# EAGLE design SensorNode (EAGLE 9.0.1)
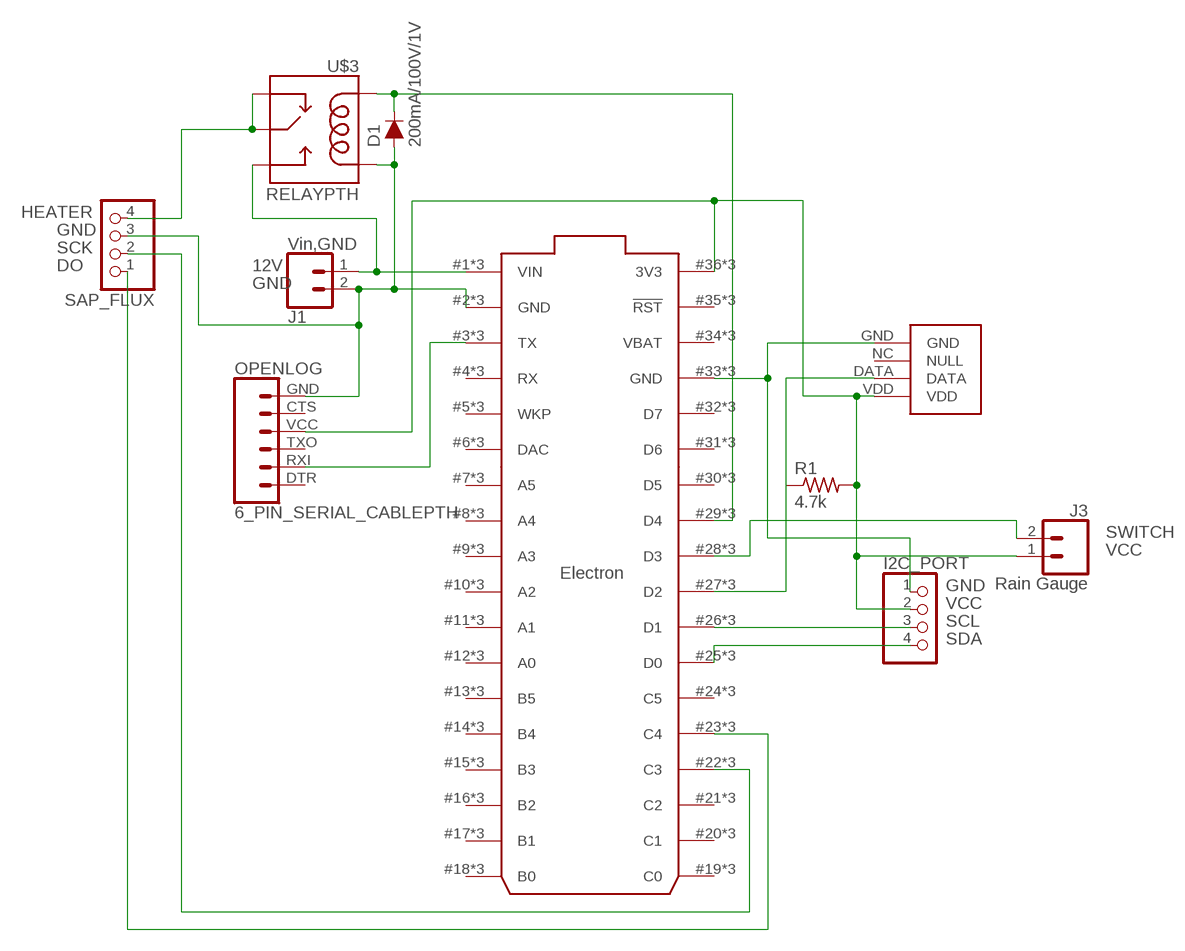
[diagram p0: schematic, sheet 1]

## Parts
D1  200mA/100V/1V  DIODE-1N4148  [DIODE-1N4148]
I2C_PORT  PINHD-1X4  [1X04]
J1  Vin,GND  CONN_023.5MM  [SCREWTERMINAL-3.5MM-2]
J3  Rain Gauge  CONN_023.5MM  [SCREWTERMINAL-3.5MM-2]
OPENLOG  6_PIN_SERIAL_CABLEPTH  [FTDI_BASIC]
R1  4.7k  R-US_0204/7  [0204/7]
SAP_FLUX  PINHD-1X4  [1X04]
U$1  ELECTRON_WITH_STACKABLE_HEADERS  [ELECTRON_STACKABLE]
U$2  DHT22  [DHT22]
U$3  RELAYPTH  [RELAY-G5Q]

## Nets
12V: J1.1 U$1.1(VIN) U$1.#1(VIN) U$1.@1(VIN) U$3.3(NO)
DO: SAP_FLUX.1 U$1.23(C4) U$1.#23(C4) U$1.@23(C4)
GND: D1.A I2C_PORT.1 J1.2 OPENLOG.GND SAP_FLUX.3 U$1.2(GND) U$1.33(GND) U$1.#2(GND) U$1.#33(GND) U$1.@2(GND) U$1.@33(GND) U$2.GND U$3.1(COIL2)
HEATER: SAP_FLUX.4 U$3.2(MAIN) U$3.4(NC)
N$4: OPENLOG.RXI U$1.3(TX) U$1.#3(TX) U$1.@3(TX)
N$7: U$1.27(D2) U$1.#27(D2) U$1.@27(D2) U$2.DATA
N$13: D1.C U$1.29(D4) U$1.#29(D4) U$1.@29(D4) U$3.5(COIL1)
SCK: SAP_FLUX.2 U$1.22(C3) U$1.#22(C3) U$1.@22(C3)
SCL: I2C_PORT.3 U$1.26(D1) U$1.#26(D1) U$1.@26(D1)
SDA: I2C_PORT.4 U$1.25(D0) U$1.#25(D0) U$1.@25(D0)
SWITCH: J3.2 U$1.28(D3) U$1.#28(D3) U$1.@28(D3)
VCC: I2C_PORT.2 J3.1 OPENLOG.VCC R1.2 U$1.36(3V3) U$1.#36(3V3) U$1.@36(3V3) U$2.VDD
Unconnected: OPENLOG.CTS OPENLOG.DTR OPENLOG.TXO R1.1 U$1.4(RX) U$1.5(WKP) U$1.6(DAC) U$1.7(A5) U$1.8(A4) U$1.9(A3) U$1.10(A2) U$1.11(A1) U$1.12(A0) U$1.13(B5) U$1.14(B4) U$1.15(B3) U$1.16(B2) U$1.17(B1) U$1.18(B0) U$1.19(C0) U$1.20(C1) U$1.21(C2) U$1.24(C5) U$1.30(D5) U$1.31(D6) U$1.32(D7) U$1.35(!RST) U$1.#4(RX) U$1.#5(WKP) U$1.#6(DAC) U$1.#7(A5) U$1.#8(A4) U$1.#9(A3) U$1.#10(A2) U$1.#11(A1) U$1.#12(A0) U$1.#13(B5) U$1.#14(B4) U$1.#15(B3) U$1.#16(B2) U$1.#17(B1) U$1.#18(B0) U$1.#19(C0) U$1.#20(C1) U$1.#21(C2) U$1.#24(C5) U$1.#30(D5) U$1.#31(D6) U$1.#32(D7) U$1.#35(!RST) U$1.@4(RX) U$1.@5(WKP) U$1.@6(DAC) U$1.@7(A5) U$1.@8(A4) U$1.@9(A3) U$1.@10(A2) U$1.@11(A1) U$1.@12(A0) U$1.@13(B5) U$1.@14(B4) U$1.@15(B3) U$1.@16(B2) U$1.@17(B1) U$1.@18(B0) U$1.@19(C0) U$1.@20(C1) U$1.@21(C2) U$1.@24(C5) U$1.@30(D5) U$1.@31(D6) U$1.@32(D7) U$1.@35(!RST) U$2.NC(NULL)

## Power pins joined to a net without a drawn wire
VBAT: U$1.34(VBAT) U$1.#34(VBAT) U$1.@34(VBAT)

## Library data of the parts
D1 = SparkFun-DiscreteSemi:DIODE: Diode These are standard reverse protection diodes and small signal diodes. SparkFun Products: SparkFun SparkPunk Sound Kit <https://www.sparkfun.com/products/11177> SparkFun ESP8266 Thing <https://www.sparkfun.com/products/13231>; PROD_ID: DIO-08378
I2C_PORT SAP_FLUX = DC_LOAD_AU:PINHD-1X4: PIN HEADER
J1 J3 = SparkFun-Connectors:CONN_02: Multi connection point. Often used as Generic Header-pin footprint for 0.1 inch spaced/style header connections On any of the 0.1 inch spaced packages, you can populate with these: Break Away Headers - Straight <https://www.sparkfun.com/products/116> (PRT-00116) Break Away Male Headers - Right Angle <https://www.sparkfun.com/products/553> (PRT-00553) Female Headers <https://www.sparkfun.com/products/115> (PRT-00115) Break Away Headers - Machine Pin <https://www.sparkfun.com/products/117> (PRT-00117) Break Away Female Headers - Swiss Machine Pin <https://www.sparkfun.com/products/743> (PRT-00743) For SCREWTERMINALS and SPRING TERMINALS visit here: Screw Terimnals on SparkFun.com <https://www.sparkfun.com/search/results?term=Screw+Terminals> (5mm/3.5mm/2.54mm spacing) This device is also useful as a general connection point to wire up your design to another part of your project. Our various solder wires solder well into these plated through hole pads. Hook-Up Wire - Assortment (Stranded, 22 AWG) <https://www.sparkfun.com/products/11375> (PRT-11375) Hook-Up Wire - Assortment (Solid Core, 22 AWG) <https://www.sparkfun.com/products/11367> (PRT-11367) View the entire wire category on our website here <https://www.sparkfun.com/categories/141> Special notes: Molex polarized connector foot print use with: PRT-08233 with associated crimp pins and housings. 2.54_SCREWTERM for use with PRT-10571. 3.5mm Screw Terminal footprints for PRT-08084 5mm Screw Terminal footprints for use with PRT-08432; PROD_ID: CONN-08399
OPENLOG = SparkFun-Connectors:6_PIN_SERIAL_CABLE: 6-pin header connection for use with the "FTDI BASIC" pinout - CABLE SIDE. Also known as "Arduino Serial Program Header". This is used on a design to provide a 6-pin connection point for serial communication usually from a USB cable (D+/D-) to these headers (RX/TX). It also has the remaining pins necessary for programming in the Arduino evironment (DTR, GND, and sometimes VCC). Note, this device has "CABLE" in the name. It is intended to be used on a design that usually lives on the end of your USB cable and prvides the converter chip (FTDI232 or FTDI231x) to commnicate serial RX/TX. The "sister" device, named "TARGET" is inteneded to be used on a design that contains a target micro-controller that you wish to program. You can populate with some of these: Female Headers <https://www.sparkfun.com/products/115> (PRT-00115) For reference (or to suit your programming needs) check out these designs: SparkFun FTDI Basic Breakout - 5V <https://www.sparkfun.com/products/9716> (DEV-09716) SparkFun FTDI Basic Breakout - 3.3V <https://www.sparkfun.com/products/9873> (DEV-09873) SparkFun FTDI SmartBasic <https://www.sparkfun.com/products/12935> (DEV-12935) SparkFun Beefy 3 - FTDI Basic Breakout <https://www.sparkfun.com/products/13746> (DEV-13746)
R1 = rcl:R-US_: RESISTOR, American symbol; SPICEPREFIX: R
U$1 = Particle-Devices:ELECTRON: The Particle Electron is a tiny development kit for creating cellular-connected electronics projects and products. It comes with a SIM card (Nano 4FF) and an affordable data plan for low-bandwidth things. Design files : here <https://github.com/particle-iot/electron> Product Page : Datasheet <https://docs.particle.io/datasheets/electron-(cellular)/electron-datasheet/> Github : Particle devices library <https://github.com/particle-iot/hardware-libraries/tree/master/Eagle>
U$2 = Particle:DHT22
U$3 = Particle:RELAY: SPDT relay (COM-00101)

## Board
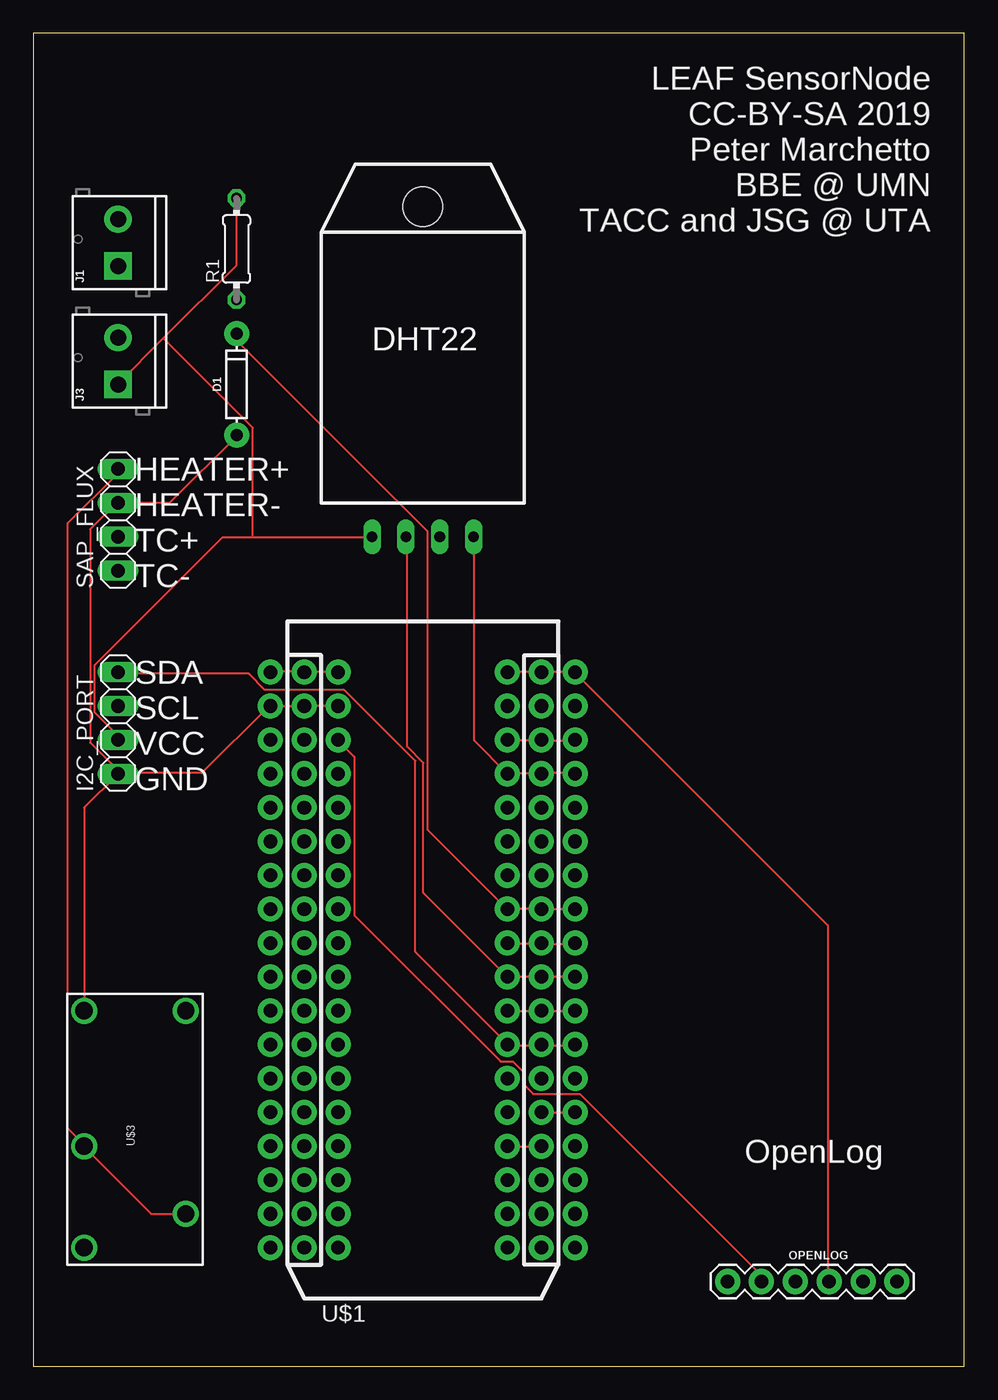
[diagram p1: board, top side]
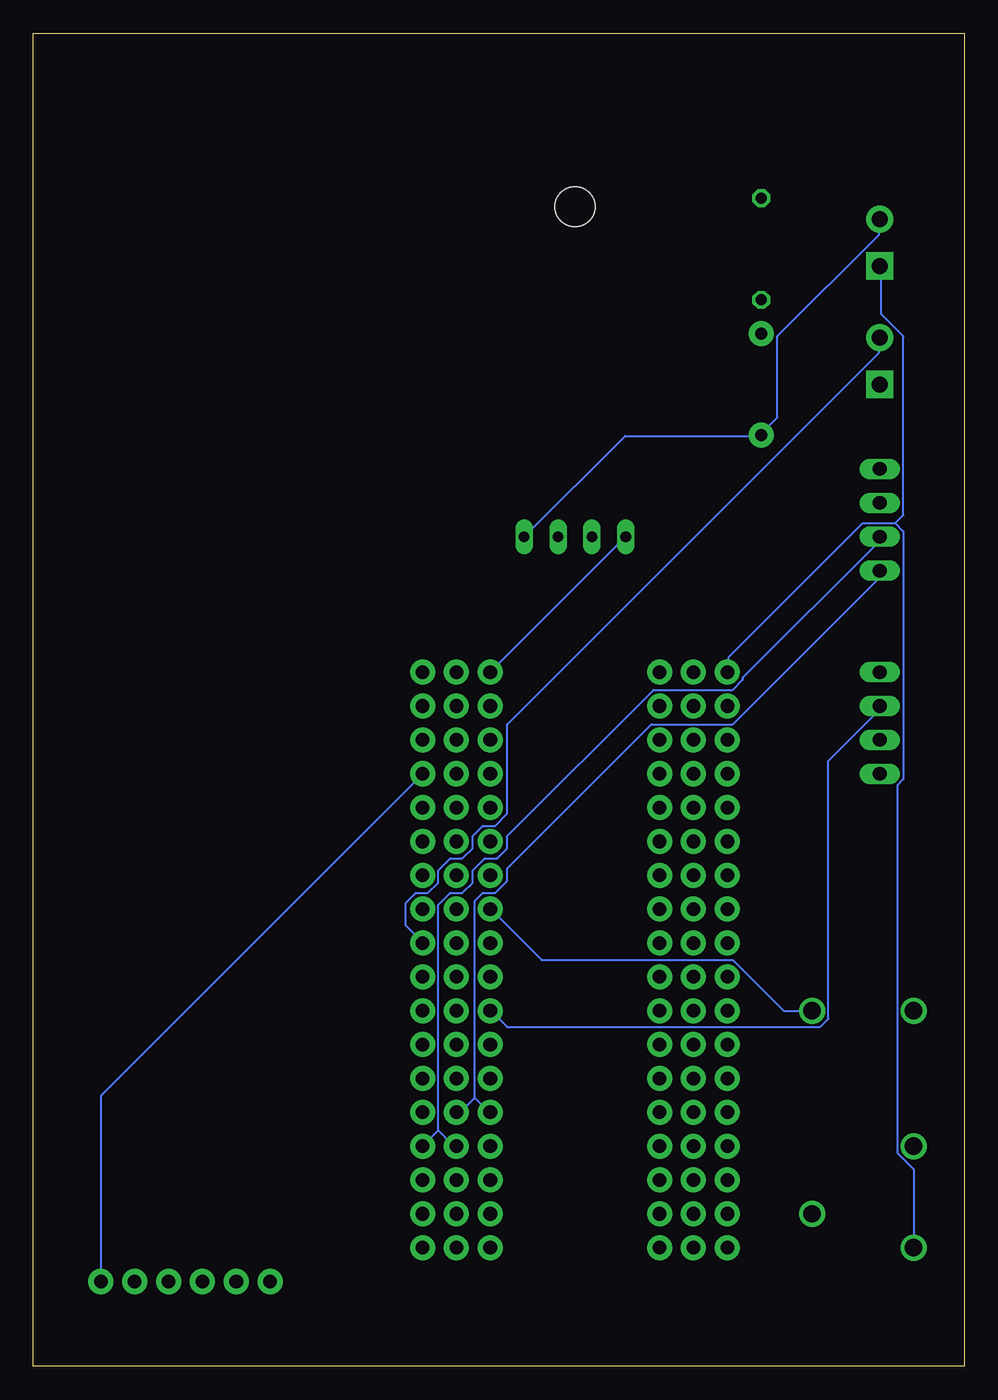
[diagram p2: board, bottom side, seen from below]

Size 69.83 x 100 mm. Coordinates in mm from the lower left corner, seen from the top.
Outline: 0,0 69.83,0 69.83,100 0,100 0,0
Copper layers (1*16): Top 0.035mm / dielectric 1.5mm / Bottom 0.035mm
Design rules "default": minimum track width 6mil, minimum drill 0.35mm, track to track 6mil, track to pad 6mil, pad to pad 6mil, via to via 6mil, smd to smd 6mil, copper to edge 40mil, drill to drill 6mil, minimum pad ring 10mil, minimum via ring 8mil, stop-mask expansion 4mil, vias tented up to drill 0mil, thermal gap 10mil

### Footprints (pad centres in the part's own frame; a part is rotated, then mirrored left to right if it is on the bottom)
DIODE-1N4148 = drill 0.9 pad 1.88: A -3.81,0; C 3.81,0
1X04 = drill 1.016 long: 1 -3.81,0; 2 -1.27,0; 3 1.27,0; 4 3.81,0
SCREWTERMINAL-3.5MM-2 = drill 1.2 pad 2.032 square: 1 0,0 | drill 1.2 pad 2.032: 2 3.5,0
FTDI_BASIC = drill 1.016 pad 1.88: CTS 10.16,0; DTR 0,0; GND 12.7,0; RXI 2.54,0; TXO 5.08,0; VCC 7.62,0
0204/7 = drill 0.813 octagon: 1 -3.81,0; 2 3.81,0
ELECTRON_STACKABLE = drill 1.016 pad 1.88: 1 1.27,46.99; 2 1.27,44.45; 3 1.27,41.91; 4 1.27,39.37; 5 1.27,36.83; 6 1.27,34.29; 7 1.27,31.75; 8 1.27,29.21; 9 1.27,26.67; 10 1.27,24.13; 11 1.27,21.59; 12 1.27,19.05; 13 1.27,16.51; 14 1.27,13.97; 15 1.27,11.43; 16 1.27,8.89; 17 1.27,6.35; 18 1.27,3.81; 19 19.05,3.81; 20 19.05,6.35; 21 19.05,8.89; 22 19.05,11.43; 23 19.05,13.97; 24 19.05,16.51; 25 19.05,19.05; 26 19.05,21.59; 27 19.05,24.13; 28 19.05,26.67; 29 19.05,29.21; 30 19.05,31.75; 31 19.05,34.29; 32 19.05,36.83; 33 19.05,39.37; 34 19.05,41.91; 35 19.05,44.45; 36 19.05,46.99; #1 3.81,46.99; #2 3.81,44.45; #3 3.81,41.91; #4 3.81,39.37; #5 3.81,36.83; #6 3.81,34.29; #7 3.81,31.75; #8 3.81,29.21; #9 3.81,26.67; #10 3.81,24.13; #11 3.81,21.59; #12 3.81,19.05; #13 3.81,16.51; #14 3.81,13.97; #15 3.81,11.43; #16 3.81,8.89; #17 3.81,6.35; #18 3.81,3.81; #19 21.59,3.81; #20 21.59,6.35; #21 21.59,8.89; #22 21.59,11.43; #23 21.59,13.97; #24 21.59,16.51; #25 21.59,19.05; #26 21.59,21.59; #27 21.59,24.13; #28 21.59,26.67; #29 21.59,29.21; #30 21.59,31.75; #31 21.59,34.29; #32 21.59,36.83; #33 21.59,39.37; #34 21.59,41.91; #35 21.59,44.45; #36 21.59,46.99; @1 -1.27,46.99; @2 -1.27,44.45; @3 -1.27,41.91; @4 -1.27,39.37; @5 -1.27,36.83; @6 -1.27,34.29; @7 -1.27,31.75; @8 -1.27,29.21; @9 -1.27,26.67; @10 -1.27,24.13; @11 -1.27,21.59; @12 -1.27,19.05; @13 -1.27,16.51; @14 -1.27,13.97; @15 -1.27,11.43; @16 -1.27,8.89; @17 -1.27,6.35; @18 -1.27,3.81; @19 16.51,3.81; @20 16.51,6.35; @21 16.51,8.89; @22 16.51,11.43; @23 16.51,13.97; @24 16.51,16.51; @25 16.51,19.05; @26 16.51,21.59; @27 16.51,24.13; @28 16.51,26.67; @29 16.51,29.21; @30 16.51,31.75; @31 16.51,34.29; @32 16.51,36.83; @33 16.51,39.37; @34 16.51,41.91; @35 16.51,44.45; @36 16.51,46.99
DHT22 = drill 0.8 long: DATA -1.27,0; GND 3.81,0; NC 1.27,0; VDD -3.81,0 | hole 3: 0,24.765
RELAY-G5Q = drill 1.3: 1 8.89,3.81; 2 -1.27,3.81; 3 -8.89,3.81; 4 -6.35,-3.81; 5 8.89,-3.81

### Placement (x,y rotation side)
D1  15.24,73.66 90 top
I2C_PORT  6.35,48.26 90 top
J1  6.35,82.55 90 top
J3  6.35,73.66 90 top
OPENLOG  52.07,6.35 0 top
R1  15.24,83.82 90 top
SAP_FLUX  6.35,63.5 90 top
U$1  19.05,5.08 0 top
U$2  29.21,62.23 0 top
U$3  7.62,17.78 90 top

### Tracks (layer width: path | path; a pad name or v marks a point on that pad's centre or on a via)
12V
  Top 0.152: U$1.@1 17.83,52.12 20.27,52.12 U$1.1 20.42,52.12 22.86,52.12 U$1.#1
  Bottom 0.152: U$3.3 3.81,14.78 5.03,16 5.03,43.59 4.57,44.04 4.57,62.64 5.18,63.25 | 5.18,63.25 7.62,63.25 17.68,53.19 17.68,52.12 U$1.@1 | 5.18,63.25 4.57,63.86 4.57,77.27 6.25,78.94 6.25,82.45 J1.1
DO
  Top 0.152: U$1.23 U$1.#23
  Bottom 0.152: 36.73,20.12 36.73,34.9 36.12,35.51 35.2,35.51 34.29,36.42 34.29,37.34 23.47,48.16 17.37,48.16 6.4,59.13 6.4,59.59 SAP_FLUX.1 | 36.73,20.12 35.66,19.05 U$1.@23 | U$1.23 37.8,19.05 36.73,20.12
GND
  Top 0.152: U$1.#2 U$1.2 U$1.@2 17.68,49.53 12.65,44.5 6.4,44.5 I2C_PORT.1 | U$3.1 3.81,41.91 I2C_PORT.1 | D1.A 15.24,69.8 10.21,64.77 SAP_FLUX.3 6.25,64.77 4.27,62.79 4.27,46.79 6.25,44.81 6.25,44.5 I2C_PORT.1 | U$2.GND 33.07,62.18 33.07,46.94 U$1.@33 35.66,44.5 38.1,44.5 | 38.1,44.5 40.54,44.5 U$1.#33 | 38.1,44.5 U$1.33
  Bottom 0.152: J1.2 6.4,85.95 6.4,84.89 14.02,77.27 14.02,71.17 15.24,69.95 D1.A 15.24,69.8 25.45,69.8 U$2.GND | OPENLOG.GND 64.77,20.27 40.69,44.35 U$1.#33
HEATER
  Top 0.152: SAP_FLUX.4 6.25,67.21 6.25,66.9 2.59,63.25 2.59,17.83 3.81,16.61 U$3.2 3.81,16.46 8.84,11.43 U$3.4
N$4
  Top 0.152: OPENLOG.RXI 54.56,6.4 54.56,6.86 41,20.42 37.49,20.42 36.73,21.18 36.73,22.1 35.97,22.86 35.05,22.86 24.08,33.83 24.08,45.72 22.86,46.94 U$1.#3
N$7
  Top 0.152: U$2.DATA 28.04,62.18 28.04,46.48 29.26,45.26 29.26,35.51 U$1.@27 35.66,29.26 38.1,29.26 | 38.1,29.26 40.54,29.26 U$1.#27 | 38.1,29.26 U$1.27
N$13
  Top 0.152: U$1.#29 U$1.29 U$1.@29 35.51,34.29 29.57,40.23 29.57,62.64 15.24,76.96 D1.C
  Bottom 0.152: U$3.5 13.56,26.67 17.37,30.48 31.7,30.48 35.51,34.29 U$1.@29
SCK
  Top 0.152: U$1.@22 35.66,16.46 38.1,16.46 U$1.22
  Bottom 0.152: 39.47,17.68 39.47,34.59 38.56,35.51 37.64,35.51 36.88,36.27 36.88,37.19 35.97,38.1 35.05,38.1 34.29,38.86 34.29,39.78 23.32,50.75 17.37,50.75 16.61,51.51 16.61,51.66 6.4,61.87 6.4,62.18 SAP_FLUX.2 | U$1.#22 39.47,17.68 | 39.47,17.68 38.41,16.61 38.1,16.61 U$1.22
SCL
  Top 0.152: U$1.@26 U$1.26 U$1.#26
  Bottom 0.152: I2C_PORT.3 6.4,49.53 6.4,49.23 10.21,45.41 10.21,26.06 10.82,25.45 34.29,25.45 35.51,26.67 U$1.@26
SDA
  Top 0.152: I2C_PORT.4 6.4,51.97 16.15,51.97 17.37,50.75 23.32,50.75 28.65,45.41 28.65,31.09 35.51,24.23 U$1.@25 35.66,24.08 38.1,24.08 | 38.1,24.08 40.54,24.08 U$1.#25 | 38.1,24.08 U$1.25
SWITCH
  Top 0.152: 38.1,31.7 35.66,31.7 U$1.@28 | 38.1,31.7 40.54,31.7 U$1.#28 | 38.1,31.7 U$1.28
  Bottom 0.152: J3.2 6.4,77.11 6.4,76.05 34.29,48.16 34.29,41.45 35.2,40.54 36.12,40.54 36.88,39.78 36.88,38.86 37.64,38.1 38.56,38.1 39.47,37.19 39.47,36.27 40.23,35.51 41.15,35.51 41.91,34.75 41.91,33.07 40.69,31.85 U$1.#28
VBAT
  Top 0.152: 38.1,46.94 35.66,46.94 U$1.@34 | 38.1,46.94 40.54,46.94 U$1.#34 | 38.1,46.94 U$1.34
VCC
  Top 0.152: R1.2 15.24,82.6 9.75,77.11 | 9.75,77.11 6.4,73.76 J3.1 | 16.46,62.18 25.3,62.18 U$2.VDD | 16.46,62.18 14.17,62.18 4.57,52.58 4.57,49.07 6.25,47.4 6.25,47.09 I2C_PORT.2 | 38.1,52.12 35.66,52.12 U$1.@36 | 38.1,52.12 40.54,52.12 U$1.#36 40.69,51.97 59.59,33.07 59.59,6.4 OPENLOG.VCC | 38.1,52.12 U$1.36 | 9.75,77.11 16.46,70.41 16.46,62.18
  Bottom 0.152: U$1.@36 U$2.VDD

### Text on the board
_tsilk: LEAF SensorNode / CC-BY-SA 2019 / Peter Marchetto / BBE @ UMN / TACC and JSG @ UTA | DHT22 | HEATER+ / HEATER- / TC+ / TC- | SDA / SCL / VCC / GND | OpenLog